# Altium schematic sheet ESP32_C3_MINI_1.SchDoc
size A4; SheetNumber: 2; SheetTotal: 4
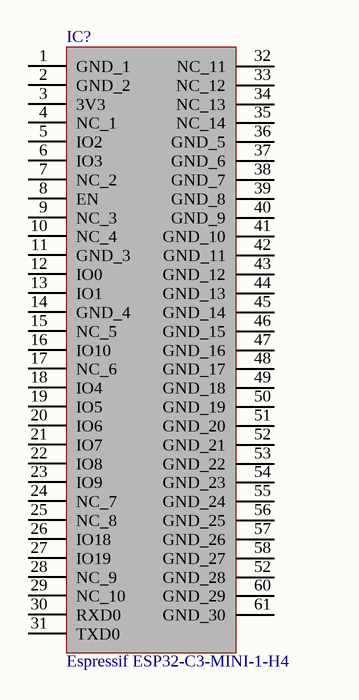
[diagram p0: ESP32_C3_MINI_1.SchDoc]

## Parts
IC?  Espressif ESP32-C3-MINI-1-H4  [Espressif ESP32C3MINI1H4]

## Nets

Not connected (* = marked no-connect by the designer): IC? 1(GND_1) 2(GND_2) 3(3V3) 4(NC_1) 5(IO2) 6(IO3) 7(NC_2) 8(EN) 9(NC_3) 10(NC_4) 11(GND_3) 12(IO0) 13(IO1) 14(GND_4) 15(NC_5) 16(IO10) 17(NC_6) 18(IO4) 19(IO5) 20(IO6) 21(IO7) 22(IO8) 23(IO9) 24(NC_7) 25(NC_8) 26(IO18) 27(IO19) 28(NC_9) 29(NC_10) 30(RXD0) 31(TXD0) 32(NC_11) 33(NC_12) 34(NC_13) 35(NC_14) 36(GND_5) 37(GND_6) 38(GND_7) 39(GND_8) 40(GND_9) 41(GND_10) 42(GND_11) 43(GND_12) 44(GND_13) 45(GND_14) 46(GND_15) 47(GND_16) 48(GND_17) 49(GND_18) 50(GND_19) 51(GND_20) 52(GND_21) 53(GND_22) 54(GND_23) 55(GND_24) 56(GND_25) 57(GND_26) 58(GND_27) 60(GND_29) 61(GND_30)

## Library data of the parts
IC? = Espressif ESP32-C3-MINI-1-H4: Integrated Circuit; Manufacturer_Name: Espressif Systems; Datasheet Link: https://www.mouser.es/datasheet/2/891/Espressif_ESP32_C3_MINI_1_Datasheet-2006822.pdf; Height: 2.55mm; Manufacturer_Part_Number: ESP32-C3-MINI-1-H4; Mouser Part Number: 356-ESP32-C3-MINI1H4; Mouser Price/Stock: https://www.mouser.co.uk/ProductDetail/Espressif-Systems/ESP32-C3-MINI-1-H4?qs=stqOd1AaK78JkwNX13Q9hQ%3D%3D